# EAGLE schematic plu (EAGLE 9.4.0)
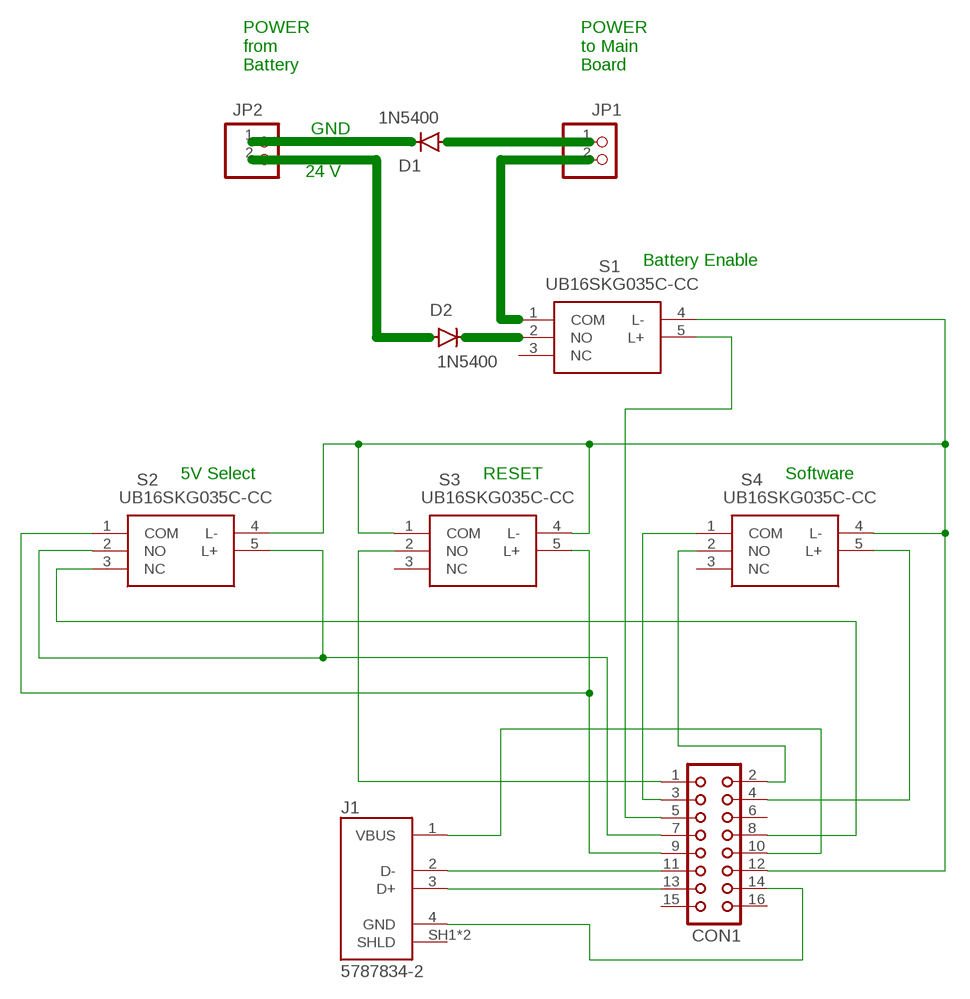
[diagram p0: schematic, sheet 1]

## Parts
CON1  CON16  [CON16]
D1  1N5400  [DO201-15]
D2  1N5400  [DO201-15]
J1  5787834-2  [TE_5787834-2]
JP1  PINHD-1X2  [1X02]
JP2  PINHD-1X2  [1X02]
S1  UB16SKG035C-CC  [UB16SKG035CCC]
S2  UB16SKG035C-CC  [UB16SKG035CCC]
S3  UB16SKG035C-CC  [UB16SKG035CCC]
S4  UB16SKG035C-CC  [UB16SKG035CCC]

## Nets
N$1: D1.A JP1.1
N$2: CON1.1 S3.2(NO)
N$3: D1.C JP2.1
N$4: D2.C S1.2(NO)
N$5: D2.A JP2.2
N$6: JP1.2 S1.1(COM)
N$7: CON1.11 J1.2(D-)
N$8: CON1.10 J1.1(VBUS)
N$11: CON1.2 S4.2(NO)
N$12: CON1.3 S4.1(COM)
N$13: CON1.13 J1.3(D+)
N$14: CON1.4 S4.5(L+)
N$15: CON1.5 S1.5(L+)
N$16: CON1.14 J1.4(GND)
N$17: CON1.7 S2.2(NO) S2.5(L+)
N$18: CON1.8 S2.3(NC)
N$19: CON1.9 S2.1(COM) S3.5(L+)
N$20: CON1.12 S1.4(L-) S2.4(L-) S3.1(COM) S3.4(L-) S4.4(L-)
Unconnected: CON1.6 CON1.15 CON1.16 J1.SH1(SHLD) J1.SH2(SHLD) S1.3(NC) S3.3(NC) S4.3(NC)

## Notes on the sheet
- POWER
  from
  Battery
- POWER
  to Main
  Board
- GND
- 24 V
- Battery Enable
- 5V Select | RESET | Software

## Library data of the parts
CON1 = con-harting:CON16: CONNECTOR; OC_FARNELL: unknown; OC_NEWARK: unknown
D1 D2 = diode:1N5400: DIODE standard rectifier, 3 A, 50 V (Motorola)
J1 = 5787834-2:5787834-2: Conn USB 2.0 Type B RCP 4 POS 2.5mm Solder ST Thru-Hole 4 Terminal 1 Port Box/Tray; COMMENT: 5787834-2; DESCRIPTION: Conn USB 2.0 Type B RCP 4 POS 2.5mm Solder ST Thru-Hole 4 Terminal 1 Port Box/Tray; DIGI-KEY_PART_NUMBER: A121598-ND; DIGI-KEY_PURCHASE_URL: https://www.digikey.com/product-detail/en/te-connectivity-amp-connectors/5787834-2/A121598-ND/2286710?utm_source=snapeda&utm_medium=aggregator&utm_campaign=symbol; EU_ROHS_COMPLIANCE: Compliant; MF: TE Connectivity; MP: 5787834-2; PACKAGE: None; TE_PURCHASE_URL: https://www.te.com/usa-en/product-5787834-2.html?te_bu=Cor&te_type=disp&te_campaign=seda_glo_cor-seda-global-disp-prtnr-fy19-seda-model-bom-cta_sma-317_1&elqCampaignId=32493
JP1 JP2 = pinhead:PINHD-1X2: PIN HEADER
S1-S4 = UB16SKG035C-CC:UB16SKG035C-CC: Pushbutton Switches ON-ON SQ .4VA RED LED & CAP PC TERM Source: Datasheet <https://www.mouser.com/datasheet/2/295/UBIlluminated-33436.pdf>; ALLIED_NUMBER: 71044456; ALLIED_PRICE-STOCK: https://www.alliedelec.com/nkkswitches-ub16skg035c-cc/71044456/; DESCRIPTION: Pushbutton Switches ON-ON SQ .4VA RED LED & CAP PC TERM; HEIGHT: 13.5mm; MANUFACTURER_NAME: NKK Switches; MANUFACTURER_PART_NUMBER: UB16SKG035C-CC; MOUSER_PART_NUMBER: 633-UB16SKG035CCC; MOUSER_PRICE-STOCK: https://www.mouser.com/Search/Refine.aspx?Keyword=633-UB16SKG035CCC

## Net classes
0 default: width 0.406 mm